# Altium project Sayma_RTM.PrjPcb (part 5 of 11)

## Sheet PWR_buck_FPGA_EXAR.SchDoc: Sayma RTM
size 420 x 297 mm; $$Internal___BlkDate: 23:43:25_12-13-18; $$Internal_NAME_PLACEHOLDER: a3sheet; $$Internal_Resolution: 00001mm; $$NotCommonProperty_@NAME: PWR_buck_FPGA_EXAR; $$NotCommonProperty_@PRINTORDER: 2; $$NotCommonProperty_@SHEET: 1; $$NotCommonProperty_@SHEETTOTAL: 1; $$NotCommonProperty_FORWARD_PCB: 0; CmpIndex: 119; Drawing Author: G.Kasprowicz; Drawing Number: Sayma RTM; Drawing Project: 8 channel SAWG; Drawing Revision: 2.0; SymIndex: 2227; Author: G.Kasprowicz; CompanyName: WUT ISE; DrawnBy: G.Kasprowicz; Organization: WUT ISE; Address1: PW ISE; Address2: Nowowiejska 15/19 00-665 Warsaw; Address3: gkasprow@gmail.com; DocumentNumber: 14; Revision: 1.0; SheetNumber: 14; SheetTotal: 18; ModifiedBy: -; CheckedDate: -; Title2: Quad channel buck (Exar); DivGrp: WUT ISE; Designer: G.Kasprowicz; ModifiedDate: -; ProjectName: Sensor Box
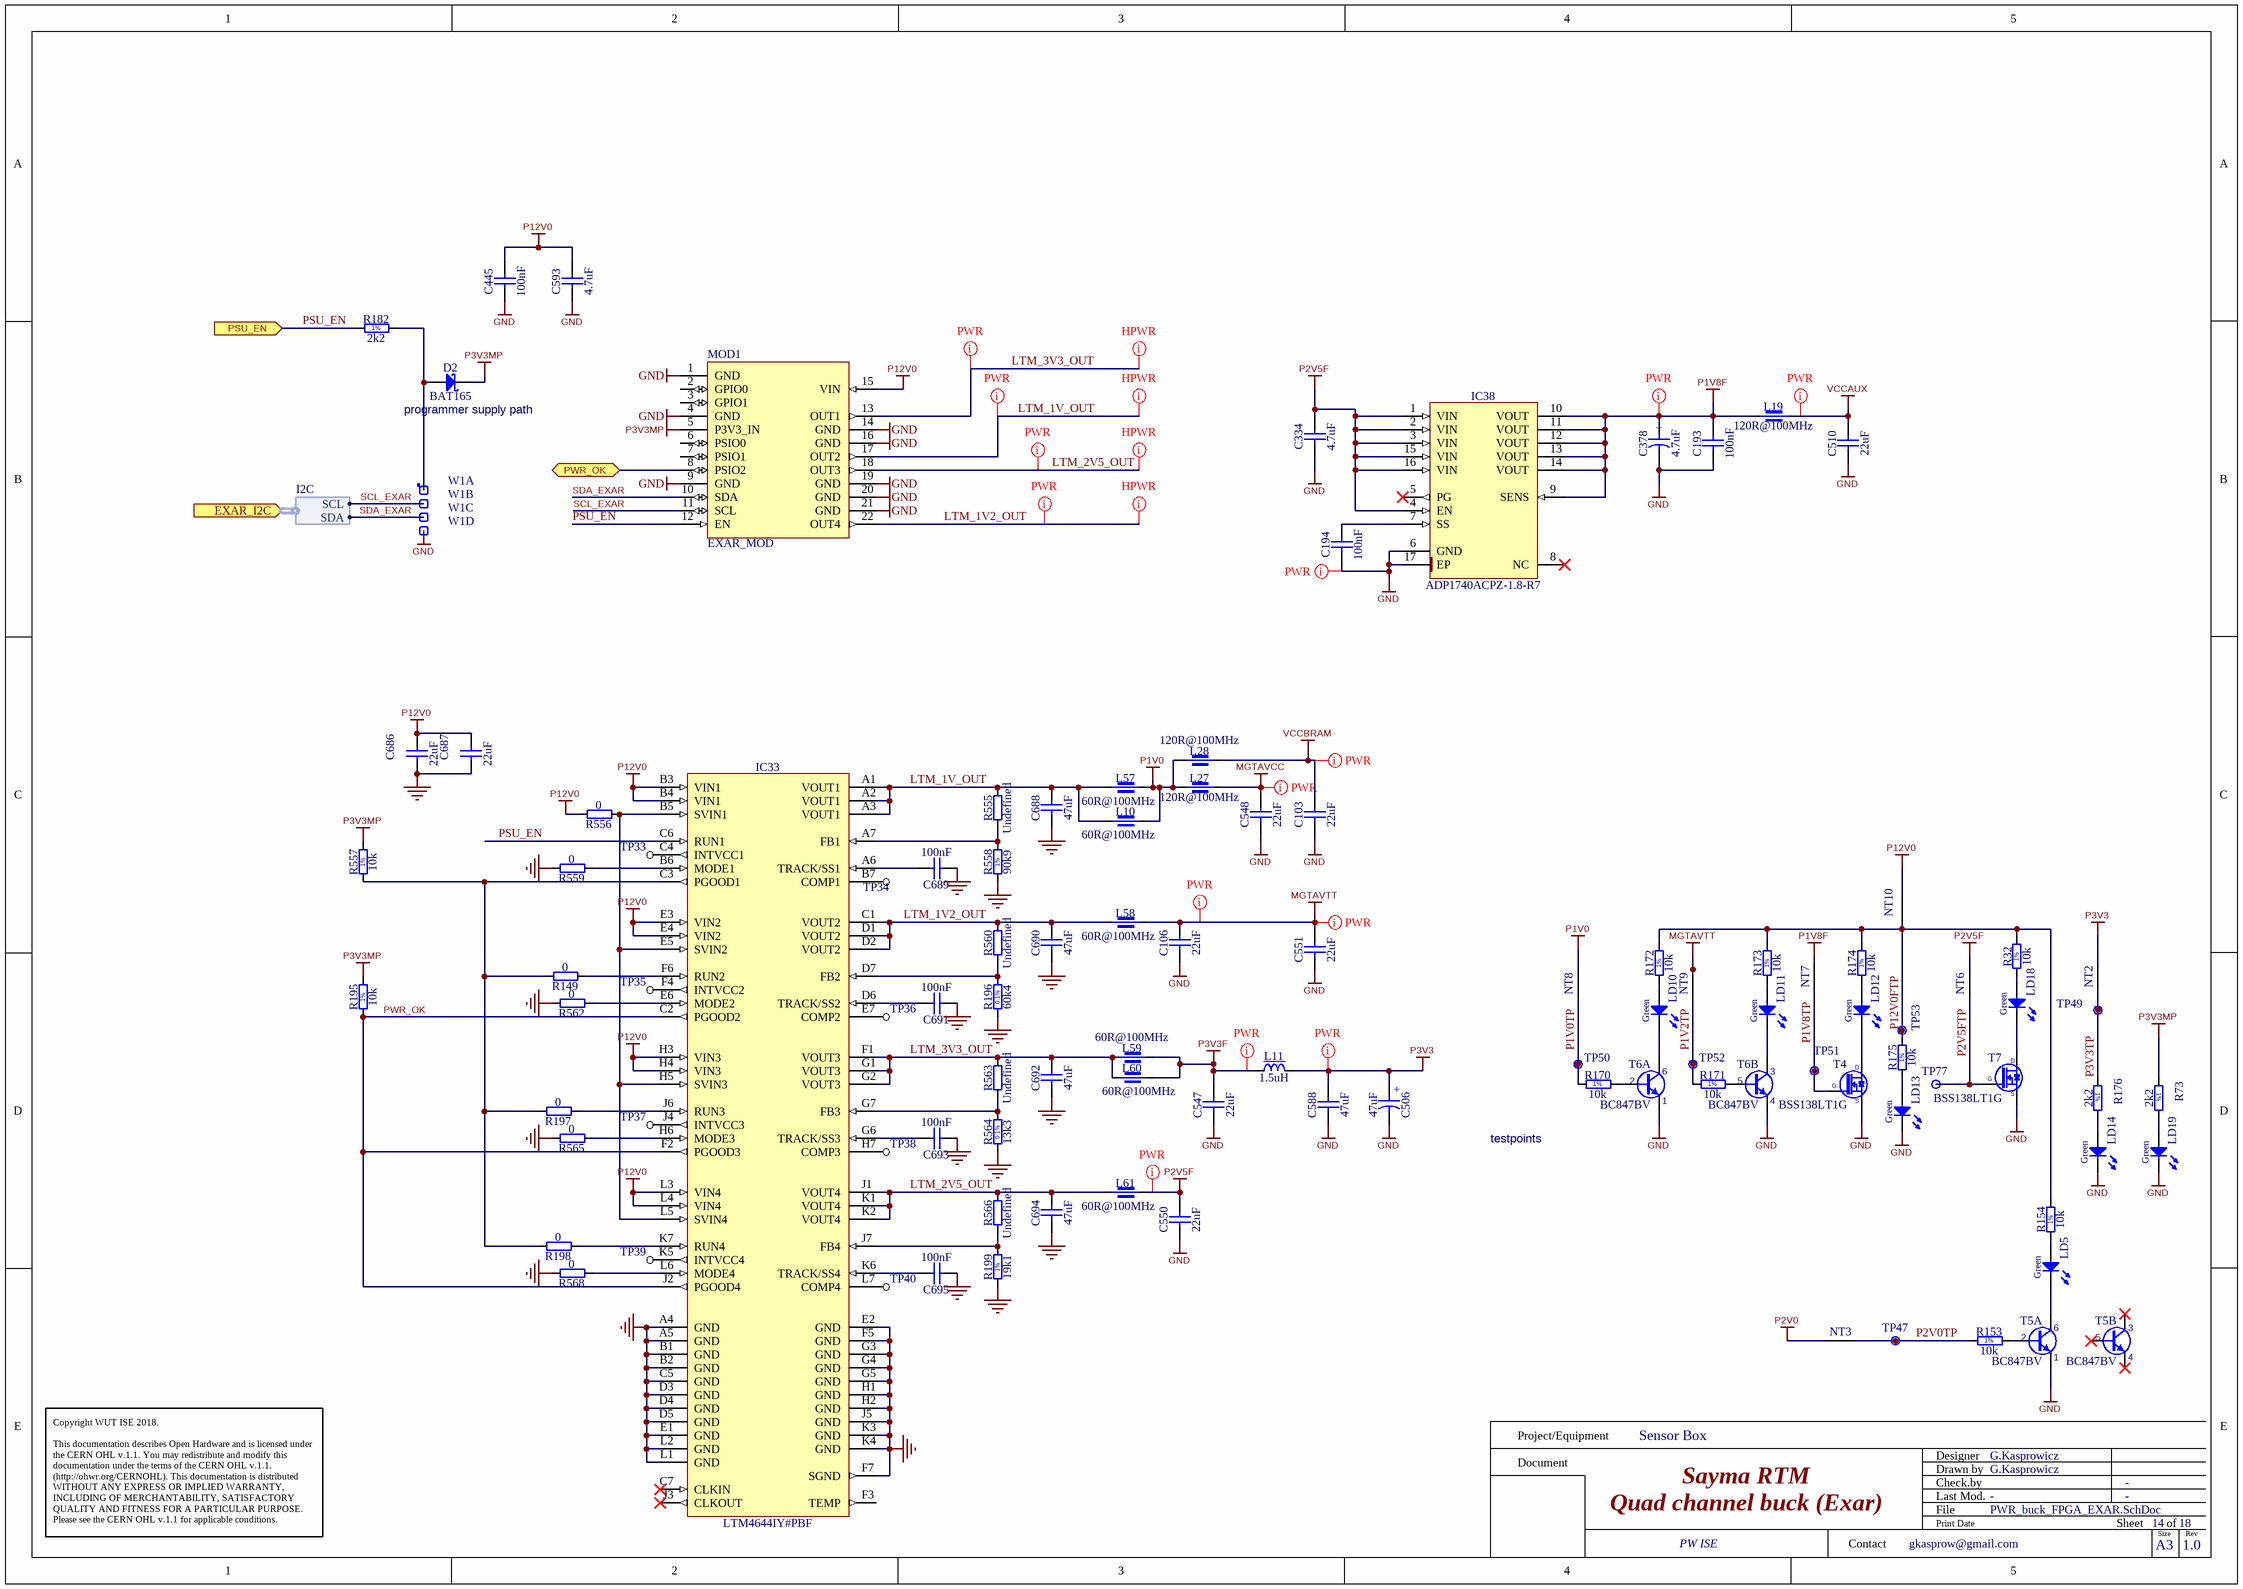
[diagram p8: PWR_buck_FPGA_EXAR.SchDoc]

### Parts
C103  22uF  [CAPC2012X135N]
C106  22uF  [CAPC2012X135N]
C193  100nF  [CAPC0603X33N]
C194  100nF  [CAPC0603X33N]
C334  4.7uF  [CAPC1608X90N]
C378  4.7uF  [CAPMP3528X210N]
C445  100nF  [CAPC1005X55N]
C506  47uF  [CAPMP6032X280N]
C510  22uF  [CAPC2012X135N]
C547  22uF  [CAPC2012X135N]
C548  22uF  [CAPC2012X135N]
C550  22uF  [CAPC2012X135N]
C551  22uF  [CAPC2012X135N]
C588  47uF  [CAPC3225X270N]
C593  4.7uF  [CAPC1709X95N]
C686  22uF  [CAPC2012X135N]
C687  22uF  [CAPC2012X135N]
C688  47uF  [CAPC2012X140N]
C689  100nF  [CAPC1005X55N]
C690  47uF  [CAPC2012X140N]
C691  100nF  [CAPC1005X55N]
C692  47uF  [CAPC2012X140N]
C693  100nF  [CAPC1005X55N]
C694  47uF  [CAPC2012X140N]
C695  100nF  [CAPC1005X55N]
D2  BAT165  [SOD2512X110N]
IC33  LTM4644IY#PBF  [BGA77C127P7X11_900X1500X521]
IC38  ADP1740ACPZ-1.8-R7  [QFN65P400X400X100-17N-S225]
L10  60R@100MHz  [INDC4516X180N]
L11  1.5uH  [IND_TDK_SPM6530]
L19  120R@100MHz  [INDC1608X95N]
L27  120R@100MHz  [INDC1608X95N]
L28  120R@100MHz  [INDC1608X95N]
L57  60R@100MHz  [INDC4516X180N]
L58  60R@100MHz  [INDC4516X180N]
L59  60R@100MHz  [INDC4516X180N]
L60  60R@100MHz  [INDC4516X180N]
L61  60R@100MHz  [INDC4516X180N]
LD5  Green  [LED_KINGBRIGHT_KPH-1608CGCK]
LD10  Green  [LED_KINGBRIGHT_KPH-1608CGCK]
LD11  Green  [LED_KINGBRIGHT_KPH-1608CGCK]
LD12  Green  [LED_KINGBRIGHT_KPH-1608CGCK]
LD13  Green  [LED_KINGBRIGHT_KPH-1608CGCK]
LD14  Green  [LED_KINGBRIGHT_KPH-1608CGCK]
LD18  Green  [LED_KINGBRIGHT_KPH-1608CGCK]
LD19  Green  [LED_KINGBRIGHT_KPH-1608CGCK]
MOD1  EXAR_MOD  [EXAR_MOD]
NT2  Net Tie  [Net Tie]  (value not drawn)  (net tie, no BOM)
NT3  Net Tie  [Net Tie]  (value not drawn)  (net tie, no BOM)
NT6  Net Tie  [Net Tie]  (value not drawn)  (net tie, no BOM)
NT7  Net Tie  [Net Tie]  (value not drawn)  (net tie, no BOM)
NT8  Net Tie  [Net Tie]  (value not drawn)  (net tie, no BOM)
NT9  Net Tie  [Net Tie]  (value not drawn)  (net tie, no BOM)
NT10  Net Tie  [Net Tie]  (value not drawn)  (net tie, no BOM)
R32  10k  [RESC1005X40N]
R73  2k2  [RESC1005X40N]
R149  0  [RESC1005X40N]
R153  10k  [RESC1005X40N]
R154  10k  [RESC1005X40N]
R170  10k  [RESC1005X40N]
R171  10k  [RESC1005X40N]
R172  10k  [RESC1005X40N]
R173  10k  [RESC1005X40N]
R174  10k  [RESC1005X40N]
R175  10k  [RESC1005X40N]
R176  2k2  [RESC1005X40N]
R182  2k2  [RESC1005X40N]
R195  10k  [RESC1005X40N]
R196  60k4  [RESC1608X55N]
R197  0  [RESC1005X40N]
R198  0  [RESC1005X40N]
R199  19k1  [RESC1608X55N]
R555  Undefined  [RESC1608X55N]
R556  0  [RESC1005X40N]
R557  10k  [RESC1005X40N]
R558  90k9  [RESC1608X55N]
R559  0  [RESC1005X40N]
R560  Undefined  [RESC1608X55N]
R562  0  [RESC1005X40N]
R563  Undefined  [RESC1608X55N]
R564  13k3  [RESC1608X55N]
R565  0  [RESC1005X40N]
R566  Undefined  [RESC1608X55N]
R568  0  [RESC1005X40N]
T4  BSS138LT1G  [SOT95P240X110-3N]
T5  BC847BV  [SOTFL50P160X60-6N]  (parts A,B of 2)
T6  BC847BV  [SOTFL50P160X60-6N]  (parts A,B of 2)
T7  BSS138LT1G  [SOT95P240X110-3N]
TP33  TP  [TP]  (value not drawn)
TP34  TP  [TP]  (value not drawn)
TP35  TP  [TP]  (value not drawn)
TP36  TP  [TP]  (value not drawn)
TP37  TP  [TP]  (value not drawn)
TP38  TP  [TP]  (value not drawn)
TP39  TP  [TP]  (value not drawn)
TP40  TP  [TP]  (value not drawn)
TP47  Test Point  [TPS127]  (value not drawn)
TP49  Test Point  [TPS127]  (value not drawn)
TP50  Test Point  [TPS127]  (value not drawn)
TP51  Test Point  [TPS127]  (value not drawn)
TP52  Test Point  [TPS127]  (value not drawn)
TP53  Test Point  [TPS127]  (value not drawn)
TP77  Test Point  [TPS127]  (value not drawn)
W1  Header 4  [SAMTEC_MTLW-104-07-L-S-250]  (value not drawn)  (parts A,B,C,D of 4)

### Ports
EXAR_I2C (in, harness I2C), PSU_EN (in), PWR_OK (bidir)

### Harnesses
I2C: SCL, SDA

### Nets
GND: C103.1 C106.1 C193.1 C194.1 C334.1 C378.2 C445.1 C506.2 C510.1 C547.1 C548.1 C550.1 C551.1 C588.1 C593.1 C686.1 C687.1 C688.1 C689.1 C690.1 C691.1 C692.1 C693.1 C694.1 C695.1 IC33.A4(GND) IC33.A5(GND) IC33.B1(GND) IC33.B2(GND) IC33.C5(GND) IC33.D3(GND) IC33.D4(GND) IC33.D5(GND) IC33.E1(GND) IC33.E2(GND) IC33.F5(GND) IC33.F7(SGND) IC33.G3(GND) IC33.G4(GND) IC33.G5(GND) IC33.H1(GND) IC33.H2(GND) IC33.J5(GND) IC33.K3(GND) IC33.K4(GND) IC33.L1(GND) IC33.L2(GND) IC38.6(GND) IC38.17(EP) LD13.1(C) LD14.1(C) LD19.1(C) MOD1.1(GND) MOD1.4(GND) MOD1.9(GND) MOD1.14(GND) MOD1.16(GND) MOD1.19(GND) MOD1.20(GND) MOD1.21(GND) R196.1 R199.1 R558.1 R559.2 R562.2 R564.1 R565.2 R568.2 T4.2(S) T5.1(E) T6.1(E) T6.4(E) T7.2(S) W1.4
MGTAVCC: C548.2 L27.2
MGTAVTT: C106.2 C551.2 L58.2 NT9.2
P1V0: L10.2 L27.1 L28.1 L57.2 NT8.2
P1V8F: C193.2 C378.1 IC38.9(SENS) IC38.10(VOUT) IC38.11(VOUT) IC38.12(VOUT) IC38.13(VOUT) IC38.14(VOUT) L19.1 NT7.2
P2V0: NT3.1
P2V5F: C334.2 C550.2 IC38.1(VIN) IC38.2(VIN) IC38.3(VIN) IC38.4(EN) IC38.15(VIN) IC38.16(VIN) L61.2 NT6.2
P3V3: C506.1 C588.2 L11.2 NT2.2
P3V3F: C547.2 L11.1 L59.2 L60.2
P3V3MP: D2.1(C) MOD1.5(P3V3_IN) R73.1 R195.2 R557.2
P12V0: C445.2 C593.2 C686.2 C687.2 IC33.B3(VIN1) IC33.B4(VIN1) IC33.E3(VIN2) IC33.E4(VIN2) IC33.H3(VIN3) IC33.H4(VIN3) IC33.L3(VIN4) IC33.L4(VIN4) MOD1.15(VIN) NT10.2 R556.2
VCCAUX: C510.2 L19.2
VCCBRAM: C103.2 L28.2
LTM_1V2_OUT: C690.2 IC33.C1(VOUT2) IC33.D1(VOUT2) IC33.D2(VOUT2) L58.1 MOD1.22(OUT4) R560.2
LTM_1V_OUT: C688.2 IC33.A1(VOUT1) IC33.A2(VOUT1) IC33.A3(VOUT1) L10.1 L57.1 MOD1.17(OUT2) R555.2
LTM_2V5_OUT: C694.2 IC33.J1(VOUT4) IC33.K1(VOUT4) IC33.K2(VOUT4) L61.1 MOD1.18(OUT3) R566.2
LTM_3V3_OUT: C692.2 IC33.F1(VOUT3) IC33.G1(VOUT3) IC33.G2(VOUT3) L59.1 L60.1 MOD1.13(OUT1) R563.2
P1V0TP: NT8.1 R170.1 TP50.1
P1V2TP: NT9.1 R171.1 TP52.1
P1V8TP: NT7.1 T4.1(G) TP51.1
P2V0TP: NT3.2 R153.1 TP47.1
P2V5FTP: NT6.1 T7.1(G) TP77.1
P3V3TP: NT2.1 R176.1 TP49.1
P12V0FTP: NT10.1 R32.2 R154.2 R172.2 R173.2 R174.2 R175.2 TP53.1
PGOOD: MOD1.8(PSIO2) ; port PWR_OK
PSU_EN: IC33.C6(RUN1) MOD1.12(EN) R182.1 ; port PSU_EN  [project net EN]
PWR_OK: IC33.C2(PGOOD2) IC33.F2(PGOOD3) IC33.J2(PGOOD4) R195.1
SCL_EXAR: MOD1.11(SCL) W1.2 ; port EXAR_I2C.SCL  [project net EXAR_I2C.SCL]
SDA_EXAR: MOD1.10(SDA) W1.3 ; port EXAR_I2C.SDA  [project net EXAR_I2C.SDA]
NetC194_2: C194.2 IC38.7(SS)
NetC689_2: C689.2 IC33.A6(TRACK/SS1)
NetC691_2: C691.2 IC33.D6(TRACK/SS2)
NetC693_2: C693.2 IC33.G6(TRACK/SS3)
NetC695_2: C695.2 IC33.K6(TRACK/SS4)
NetD2_2: D2.2(A) R182.2 W1.1
NetIC33_A7: IC33.A7(FB1) R555.1 R558.2
NetIC33_B5: IC33.B5(SVIN1) IC33.E5(SVIN2) IC33.H5(SVIN3) IC33.L5(SVIN4) R556.1
NetIC33_B6: IC33.B6(MODE1) R559.1
NetIC33_B7: IC33.B7(COMP1) TP34.1
NetIC33_C3: IC33.C3(PGOOD1) R149.2 R197.2 R198.2 R557.1
NetIC33_C4: IC33.C4(INTVCC1) TP33.1
NetIC33_D7: IC33.D7(FB2) R196.2 R560.1
NetIC33_E6: IC33.E6(MODE2) R562.1
NetIC33_E7: IC33.E7(COMP2) TP36.1
NetIC33_F4: IC33.F4(INTVCC2) TP35.1
NetIC33_F6: IC33.F6(RUN2) R149.1
NetIC33_G7: IC33.G7(FB3) R563.1 R564.2
NetIC33_H6: IC33.H6(MODE3) R565.1
NetIC33_H7: IC33.H7(COMP3) TP38.1
NetIC33_J4: IC33.J4(INTVCC3) TP37.1
NetIC33_J6: IC33.J6(RUN3) R197.1
NetIC33_J7: IC33.J7(FB4) R199.2 R566.1
NetIC33_K5: IC33.K5(INTVCC4) TP39.1
NetIC33_K7: IC33.K7(RUN4) R198.1
NetIC33_L6: IC33.L6(MODE4) R568.1
NetIC33_L7: IC33.L7(COMP4) TP40.1
NetLD5_1: LD5.1(C) T5.6(C)
NetLD5_2: LD5.2(A) R154.1
NetLD10_1: LD10.1(C) T6.6(C)
NetLD10_2: LD10.2(A) R172.1
NetLD11_1: LD11.1(C) T6.3(C)
NetLD11_2: LD11.2(A) R173.1
NetLD12_1: LD12.1(C) T4.3(D)
NetLD12_2: LD12.2(A) R174.1
NetLD13_2: LD13.2(A) R175.1
NetLD14_2: LD14.2(A) R176.2
NetLD18_1: LD18.1(C) T7.3(D)
NetLD18_2: LD18.2(A) R32.1
NetLD19_2: LD19.2(A) R73.2
NetR153_2: R153.2 T5.2(B)
NetR170_2: R170.2 T6.2(B)
NetR171_2: R171.2 T6.5(B)

Not connected (* = marked no-connect by the designer): IC33 C7(CLKIN)* F3(TEMP) J3(CLKOUT)*; IC38 5(PG)* 8(NC)*; MOD1 2(GPIO0) 3(GPIO1) 6(PSIO0) 7(PSIO1); T5 3(C)* 4(E)* 5(B)*

### Layout directives
net class PWR: GND, LTM_1V2_OUT, LTM_1V_OUT, LTM_2V5_OUT, LTM_3V3_OUT, MGTAVCC, MGTAVTT, P1V8F, P2V5F, P3V3, P3V3F, VCCAUX, VCCBRAM
net class HPWR: LTM_1V2_OUT, LTM_1V_OUT, LTM_2V5_OUT, LTM_3V3_OUT

### Notes on the sheet
- (near D2) programmer supply path
- testpoints
- Project/Equipment
- Document
- Designer
- Drawn by
- Check.by
- Copyright WUT ISE 2018.
  This documentation describes Open Hardware and is licensed under the CERN OHL v.1.1. You may redistribute and modify this documentation under the terms of the CERN OHL v.1.1. (http://ohwr.org/CERNOHL). This documentation is distributed WITHOUT ANY EXPRESS OR IMPLIED WARRANTY, INCLUDING OF MERCHANTABILITY, SATISFACTORY QUALITY AND FITNESS FOR A PARTICULAR PURPOSE. Please see the CERN OHL v.1.1 for applicable conditions.
- Contact
- File
- Last Mod.
- Print Date
- Sheet
- Size
- A3
- of
- Rev
- (in symbol CTE3528-21_4.7UF_35V_10%) +
- (in symbol CTE6032-28_47UF_16V_10%_LESR0350) +
- (in symbol R0402_2K2_1%_0.0625W_100PPM) 1%
- (in symbol R0402_10K_1%_0.0625W_100PPM) 1%
- (in symbol R0603_13K3_0.1%_0.063W_10PPM) 0.1%
- (in symbol R0603_19k1_1%_0.1W_100PPM) 1%
- (in symbol R0603_60K4_0.1%_0.063W_10PPM) 0.1%
- (in symbol R0603_90K9_1%_0.1W_100PPM) 1%

### Library data of the parts
C103 C106 C510 C547 C548 C550 C551 = CC0805_22UF_6.3V_20%_X5R: Non-polarised capacitor; Manufacturer: GENERIC; Manufacturer1 Part Number: C0805C226M9PAC7800; Part Description: SMD Multilayer Chip Ceramic Capacitor; TC: X5R; Tolerance: ±20%; Voltage: 6.3V; Case: 0805; Manufacturer Part Number: CC0805_22UF_6.3V_20%_X5R; Manufacturer1 Example: KEMET; Part Number: CC0805_22UF_6.3V_20%_X5R; Pin Count: 2; SMD: Yes; Status: Preferred; Value: 22uF; Component Kind: Standard; Component Type: Standard; Mounted: Yes; Socket: No; Sense: No; Manufacturer1 ComponentHeight: 1.45mm; HelpURL: \\cern.ch\dfs\Applications\Altium\Datasheets\CC1206_X5R_KEMET.pdf; Author: CERN DEM JLC; CreateDate: 03.12.2007; LatestRevisionDate: 03.12.2007
C193 C194 = CC0201_100NF_6.3V_10%_X5R: Non-polarised capacitor; Manufacturer: GENERIC; Manufacturer1 Part Number: 02016D104KAT2A; Part Description: SMD Multilayer Chip Ceramic Capacitor; TC: X5R; Tolerance: ±10%; Voltage: 6.3V; Case: 0201; Manufacturer Part Number: CC0201_100NF_6.3V_10%_X5R; Manufacturer1 Example: AVX; Part Number: CC0201_100NF_6.3V_10%_X5R; Pin Count: 2; SMD: Yes; Status: Not Recommended; Value: 100nF; Component Kind: Standard; Component Type: Standard; Mounted: Yes; Socket: No; Sense: No; Manufacturer1 ComponentHeight: 0.33mm; HelpURL: \\cern.ch\dfs\Applications\Altium\Datasheets\CC0201_X5R_AVX.pdf; Author: CERN DEM JLC; CreateDate: 03.12.2007; LatestRevisionDate: 03.12.2007
C334 = CC0603_4.7UF_25V_10%_X5R: Non-polarised capacitor; Manufacturer: GENERIC; Manufacturer1 Part Number: GRM188R61E475KE11D; Part Description: SMD Multilayer Chip Ceramic Capacitor; Tolerance: ±10%; Voltage: 25V; TC: X5R; Case: 0603; Manufacturer Part Number: CC0603_4.7UF_25V_10%_X5R; Manufacturer1 Example: MURATA; Part Number: CC0603_4.7UF_25V_10%_X5R; Pin Count: 2; SMD: Yes; Value: 4.7uF; Component Kind: Standard; Component Type: Standard; Status: None; Mounted: Yes; Socket: No; Sense: No; Manufacturer1 ComponentHeight: 0.95mm; HelpURL: \\cern.ch\dfs\Applications\Altium\Datasheets\CC0603_MURATA_GRM188R61E475KE11D.pdf; Author: CERN DEM JLC; CreateDate: 10.11.2014; LatestRevisionDate: 10.11.2014
C378 = CTE3528-21_4.7UF_35V_10%: Polarised capacitor; Manufacturer: GENERIC; Manufacturer1 Part Number: TAJB475K035R; Part Description: Solid Tantalum Chip Capacitor; Tolerance: ±10%; Voltage: 35V; Case: B; Manufacturer Part Number: CTE3528-21_4.7UF_35V_10%; Manufacturer1 Example: AVX; Part Number: CTE3528-21_4.7UF_35V_10%; Pin Count: 2; SMD: Yes; Value: 4.7uF; Component Kind: Standard; Component Type: Standard; Status: Preferred; Mounted: Yes; Socket: No; Sense: No; Manufacturer1 ComponentHeight: 2.1mm; HelpURL: \\cern.ch\dfs\Applications\Altium\Datasheets\CTE_AVX_TAJ.pdf; Author: CERN DEM JLC; CreateDate: 03.12.2007; LatestRevisionDate: 03.12.2007
C445 = CC0402_100NF_16V_10%_X5R: Non-polarised capacitor; Manufacturer: GENERIC; Manufacturer1 Part Number: GRM155R61C104KA88D; Part Description: SMD Multilayer Chip Ceramic Capacitor; TC: X5R; Tolerance: ±10%; Voltage: 16V; Case: 0402; Manufacturer Part Number: CC0402_100NF_16V_10%_X5R; Manufacturer1 Example: MURATA; Part Number: CC0402_100NF_16V_10%_X5R; Pin Count: 2; SMD: Yes; Status: None; Value: 100nF; Component Kind: Standard; Component Type: Standard; Mounted: Yes; Socket: No; Sense: No; Manufacturer1 ComponentHeight: 0.55mm; HelpURL: \\cern.ch\dfs\Applications\Altium\Datasheets\CC0402_X5R_MURATA_GRM.pdf; Author: CERN DEM JLC; CreateDate: 10.12.2013; LatestRevisionDate: 10.12.2013
C506 = CTE6032-28_47UF_16V_10%_LESR0350: Polarised capacitor; Manufacturer: GENERIC; Manufacturer1 Part Number: TPSC476K016R0350; Part Description: Low ESR 0R350 Solid Tantalum Chip Capacitor; Tolerance: ±10%; Voltage: 16V; Case: C; Manufacturer Part Number: CTE6032-28_47UF_16V_10%_LESR0350; Manufacturer1 Example: AVX; Part Number: CTE6032-28_47UF_16V_10%_LESR0350; Pin Count: 2; SMD: Yes; Status: Preferred; Value: 47uF; Component Kind: Standard; Component Type: Standard; Mounted: Yes; Socket: No; Sense: No; Manufacturer1 ComponentHeight: 2.8mm; HelpURL: \\cern.ch\dfs\Applications\Altium\Datasheets\CTE-LESR_AVX_TPS.pdf; Author: CERN DEM JLC; CreateDate: 05.05.2008; LatestRevisionDate: 20.01.2009
C588 = CC1210_47UF_10V_10%_X7R: Non-polarised capacitor; Manufacturer: GENERIC; Manufacturer1 Part Number: GRM32ER71A476KE15; Part Description: SMD Multilayer Chip Ceramic Capacitor; TC: X7R; Tolerance: ±10%; Voltage: 10V; Case: 1210; Manufacturer Part Number: CC1210_47UF_10V_10%_X7R; Manufacturer1 Example: MURATA; Part Number: CC1210_47UF_10V_10%_X7R; Pin Count: 2; SMD: Yes; Status: None; Value: 47uF; Component Kind: Standard; Component Type: Standard; Mounted: Yes; Socket: No; Sense: No; Manufacturer1 ComponentHeight: 2.7mm; HelpURL: \\cern.ch\dfs\Applications\Altium\Datasheets\CC1210_X7R_MURATA.pdf; Author: CERN DEM BC; CreateDate: 18.11.2015; LatestRevisionDate: 18.11.2015
C593 = CC0603_4.7UF_16V_10%_X5R: Non-polarised capacitor; Manufacturer: GENERIC; Manufacturer1 Part Number: EMK107ABJ475KA-T; Part Description: SMD Multilayer Chip Ceramic Capacitor; TC: X5R; Tolerance: ±10%; Voltage: 16V; Case: 0603; Manufacturer Part Number: CC0603_4.7UF_16V_10%_X5R; Manufacturer1 Example: TAIYO YUDEN; Part Number: CC0603_4.7UF_16V_10%_X5R; Pin Count: 2; SMD: Yes; Status: None; Value: 4.7uF; Component Kind: Standard; Component Type: Standard; Mounted: Yes; Socket: No; Sense: No; Manufacturer1 ComponentHeight: 0.95mm; HelpURL: \\cern.ch\dfs\Applications\Altium\Datasheets\CC0603_X7R_TAIYO-YUDEN_HIGH-VALUE.pdf; Author: CERN DEM JLC; CreateDate: 16.12.2013; LatestRevisionDate: 16.09.2014
C686 C687 = CC0805_22UF_16V_10%_X5R: Non-polarised capacitor; Manufacturer: GENERIC; Part Description: SMD Multilayer Chip Ceramic Capacitor; Manufacturer1 Part Number: C2012X5R1C226KT; Tolerance: ±10%; Voltage: 16V; TC: X5R; Manufacturer Part Number: CC0805_22UF_16V_10%_X5R; Part Number: CC0805_22UF_16V_10%_X5R; Value: 22uF; Component Kind: Standard; Component Type: Standard; Pin Count: 2; Status: Preferred; Case: 0805; Mounted: Yes; Socket: No; SMD: Yes; Sense: No; Manufacturer1 Example: TDK; Manufacturer1 ComponentHeight: 1.35mm; HelpURL: \\cern.ch\dfs\Applications\Altium\Datasheets\CC0805_X5R_TDK_C.pdf; Author: CERN DEM JLC; CreateDate: 25.10.2012; LatestRevisionDate: 25.10.2012
C688 C690 C692 C694 = CC0805_47UF_6.3V_20%_X5R: Non-polarised capacitor; Manufacturer: GENERIC; Part Description: SMD Multilayer Chip Ceramic Capacitor; Manufacturer1 Part Number: C0805C476M9PACTU; Tolerance: ±20%; Voltage: 6.3V; TC: X5R; Manufacturer Part Number: CC0805_47UF_6.3V_20%_X5R; Part Number: CC0805_47UF_6.3V_20%_X5R; Value: 47uF; Component Kind: Standard; Component Type: Standard; Pin Count: 2; Status: Preferred; Case: 0805; Mounted: Yes; Socket: No; SMD: Yes; Sense: No; Manufacturer1 Example: KEMET; Manufacturer1 ComponentHeight: 1.4mm; HelpURL: \\cern.ch\dfs\Applications\Altium\Datasheets\CC0805_X5R_KEMET.pdf; Author: CERN DEM JLC; CreateDate: 16.10.2012; LatestRevisionDate: 16.10.2012
C689 C691 C693 C695 = CC0402_100NF_16V_10%_X5R: Non-polarised capacitor; Part Description: SMD Multilayer Chip Ceramic Capacitor; Manufacturer: GENERIC; Manufacturer1 Part Number: GRM155R61C104KA88D; Voltage: 16V; TC: X5R; Tolerance: ±10%; Part Number: CC0402_100NF_16V_10%_X5R; Component Kind: Standard; Component Type: Standard; Pin Count: 2; Value: 100nF; Status: None; Manufacturer Part Number: CC0402_100NF_16V_10%_X5R; Case: 0402; Mounted: Yes; Socket: No; SMD: Yes; Sense: No; Manufacturer1 Example: MURATA; Manufacturer1 ComponentHeight: 0.55mm; HelpURL: \\cern.ch\dfs\Applications\Altium\Datasheets\CC0402_X5R_MURATA_GRM.pdf; Author: CERN DEM JLC; CreateDate: 10.12.2013; LatestRevisionDate: 10.12.2013
D2 = BAT165: Schottky Diode; Manufacturer: INFINEON; Part Description: Medium Power AF Schottky Diode; Bonding: No; Power: 750mA; PressFit: No; Voltage: 40V; Case: SOD323; ComponentHeight: 1.1mm; Device: BAT165; Manufacturer Part Number: BAT165; Mounted: Yes; PackageDescription: Small Outline Diode (SOD-323), 1.70mm W X 1.25mm L X 1.10mm H body,  IPC Medium Density; Part Number: BAT165; Pin Count: 2; Sense: No; SMD: Yes; Socket: No; Component Kind: Standard; Component Type: Standard; HelpURL: \\cern.ch\dfs\Applications\Altium\Datasheets\BAT165.pdf; Author: CERN DEM JLC; CreateDate: 12.11.2014; LatestRevisionDate: 12.11.2014
IC33 = LTM4644IY#PBF: Quad DC/DC µModule Regulator with Configurable 4A Output Array; Part Description: 4V-14V to 0.6V-5.5V Quad DC/DC uModule (Power Module) Regulator with Configurable 4A Output Array; Manufacturer: LINEAR TECHNOLOGY; PressFit: No; Bonding: No; Part Number: LTM4644IY#PBF; Component Kind: Standard; Component Type: Standard; Device: LTM4644IY#PBF; PackageDescription: BGA, 1.27mm Pitch, Rect.; 77 Pin, 7 Columns X 11 Rows, 9.00mm X 15.00mm X 5.21mm H; Manufacturer Part Number: LTM4644IY#PBF; Pin Count: 77; Case: BGA77; Mounted: Yes; Socket: No; SMD: Yes; Sense: No; ComponentHeight: 5.21mm; HelpURL: \\cern.ch\dfs\Applications\Altium\Datasheets\LTM4644IY#PBF.pdf; Author: CERN DEM JLC; CreateDate: 25.04.2018; LatestRevisionDate: 25.04.2018
IC38 = ADP1740ACPZ-1.8-R7: 2A, Low-Dropout Linear Regulator; Manufacturer: ANALOG DEVICES; Part Description: 1.8V, 2A, Low-Dropout Linear Regulator; Bonding: No; PressFit: No; Case: QFN16; ComponentHeight: 1mm; Device: ADP1740ACPZ-1.8-R7; Manufacturer Part Number: ADP1740ACPZ-1.8-R7; Mounted: Yes; PackageDescription: QFN, 0.65mm pitch,square; 4 pin X 4 pin, 4mm X 4mm X 1mm H body (w/thermal tab 2.25 X 2.25mm),  IPC Medium Density; Part Number: ADP1740ACPZ-1.8-R7; Pin Count: 17; Sense: No; SMD: Yes; Socket: No; Component Kind: Standard; Component Type: Standard; HelpURL: \\cern.ch\dfs\Applications\Altium\Datasheets\ADP1740ACPZ-1.8-R7.pdf; Author: CERN DEM JLC; CreateDate: 05.02.2013; LatestRevisionDate: 05.02.2013
L10 L57-L61 = IND1806_MURATA_BLM41PG600SN1L: Manufacturer: MURATA; Part Description: SMD EMI Suppression Chip Ferrite Bead (BLM41P Series); Power: 6A; Resistance: 0.01R; Case: 1806; ComponentHeight: 1.8mm; Manufacturer Part Number: BLM41PG600SN1L; Part Number: IND1806_MURATA_BLM41PG600SN1L; Pin Count: 2; SMD: Yes; Value: 60R@100MHz; Component Kind: Standard; Component Type: Standard; Status: None; Mounted: Yes; Socket: No; Sense: No; HelpURL: \\cern.ch\dfs\Applications\Altium\Datasheets\IND1806_MURATA_BLM41P.pdf; Author: CERN DEM JLC; CreateDate: 02.12.2009; LatestRevisionDate: 02.12.2009
L11 = IND_1.5UH_20%_TDK_SPM6530: Inductor With Core; Manufacturer Part Number: SPM6530T-1R5M100; Manufacturer: TDK; Part Description: SMD Inductor for Power Circuits (Wound Metal), SPM Series; Power: 11A; Resistance: 0.0097R; Tolerance: ±20%; ComponentHeight: 3mm; Part Number: IND_1.5UH_20%_TDK_SPM6530; Pin Count: 2; SMD: Yes; Value: 1.5uH; Component Kind: Standard; Component Type: Standard; Status: None; Mounted: Yes; Socket: No; Sense: No; HelpURL: \\cern.ch\dfs\Applications\Altium\Datasheets\IND_TDK_SPM6530.pdf; Author: CERN DEM MR; CreateDate: 08.11.2016; LatestRevisionDate: 08.11.2016
L19 L27 L28 = IND0603_MURATA_BLM18PG121SN1D: Manufacturer: MURATA; Part Description: SMD EMIFIL Chip Ferrite Bead; Power: 2A; Resistance: 0.05R; Case: 0603; ComponentHeight: 0.95mm; Manufacturer Part Number: BLM18PG121SN1D; Part Number: IND0603_MURATA_BLM18PG121SN1D; Pin Count: 2; SMD: Yes; Value: 120R@100MHz; Component Kind: Standard; Component Type: Standard; Status: None; Mounted: Yes; Socket: No; Sense: No; HelpURL: \\cern.ch\dfs\Applications\Altium\Datasheets\IND0603_MURATA_BLM18P.pdf; Author: CERN DEM BC; CreateDate: 27.07.2015; LatestRevisionDate: 25.10.2018
LD5 LD10-LD14 LD18 LD19 = LED_KINGBRIGHT_KPH-1608CGCK: LED Green 1C 2A; Part Description: SMD Green LED, Case 1.6mmX0.8mm(0603), 0.65mm Thickness; Bonding: No; PressFit: No; Author: CERN DEM JLC; Color: Green; Component Kind: Standard; Component Type: Standard; ComponentHeight: 0.65mm; CreateDate: 03.07.2017; HelpURL: \\cern.ch\dfs\Applications\Altium\Datasheets\LED_KINGBRIGHT_KPH-1608CGCK.pdf; LatestRevisionDate: 03.07.2017; Manufacturer Part Number: KPH-1608CGCK; Manufacturer: KINGBRIGHT; Mounted: Yes; PackageDescription: SMT Green LED, Case 0603, Body L 1.6 x W 0.8mm H 0.65mm; Part Number: LED_KINGBRIGHT_KPH-1608CGCK; Pin Count: 2; Sense: No; SMD: Yes; Socket: No
MOD1 = DC/DC_EXAR_MOD: 4 channel PCB module based on XRP7724ILB-F
NT2 NT3 NT6-NT10 = Net Tie: Part Description: Net Tie (2 Nets); Mounted: No; Part Number: Net Tie; Component Type: Net Tie; Pin Count: 2; Family: Net Tie; Socket: No; SMD: No; Sense: No; Status: None; ComponentHeight: 0mm; HelpURL: Undefined; Author: CERN DEM JLC; CreateDate: 22.03.2011; LatestRevisionDate: 22.03.2011; PackageDescription: 2 Plated Through Hole For Coaxial Cable Link: Hole Dia.=1.4mm Pad Dia.=2.5mm
R32 R153 R154 R170-R175 = R0402_10K_1%_0.0625W_100PPM: Resistor - 1%; Manufacturer: GENERIC; Manufacturer1 Part Number: 232270671003L; Part Description: General Purpose Thick Film Chip Resistor; TC: ±100ppm/°C; PressFit: No; Case: 0402; Manufacturer Part Number: R0402_10K_1%_0.0625W_100PPM; Manufacturer1 ComponentHeight: 0.4mm; Manufacturer1 Example: YAGEO PHYCOMP; Part Number: R0402_10K_1%_0.0625W_100PPM; Pin Count: 2; Power: 0.0625W; Sense: No; SMD: Yes; Status: Not Recommended; Tolerance: ±1%; Value: 10k; Component Kind: Standard; Component Type: Standard; Mounted: Yes; Socket: No; HelpURL: \\cern.ch\dfs\Applications\Altium\Datasheets\R0402_Phycomp_RC0402.pdf; Author: CERN DEM JLC; CreateDate: 03.12.2007; LatestRevisionDate: 17.10.2012
R73 R176 R182 = R0402_2K2_1%_0.0625W_100PPM: Resistor - 1%; Manufacturer: GENERIC; Manufacturer1 Part Number: 232270672202L; Part Description: General Purpose Thick Film Chip Resistor; TC: ±100ppm/°C; PressFit: No; Case: 0402; Manufacturer Part Number: R0402_2K2_1%_0.0625W_100PPM; Manufacturer1 ComponentHeight: 0.4mm; Manufacturer1 Example: YAGEO PHYCOMP; Part Number: R0402_2K2_1%_0.0625W_100PPM; Pin Count: 2; Power: 0.0625W; Sense: No; SMD: Yes; Status: Not Recommended; Tolerance: ±1%; Value: 2k2; Component Kind: Standard; Component Type: Standard; Mounted: Yes; Socket: No; HelpURL: \\cern.ch\dfs\Applications\Altium\Datasheets\R0402_Phycomp_RC0402.pdf; Author: CERN DEM JLC; CreateDate: 03.12.2007; LatestRevisionDate: 17.10.2012
R149 R197 R198 R556 R559 R562 R565 R568 = R0402_0R_JUMPER: Resistor; Manufacturer: GENERIC; Part Description: 1A (0.05R Max DC Resistance) Zero Ohm Jumper; Manufacturer1 Part Number: 232270591001L; PressFit: No; Manufacturer Part Number: R0402_0R_JUMPER; Part Number: R0402_0R_JUMPER; Value: 0; Component Kind: Standard; Component Type: Standard; Pin Count: 2; Status: Not Recommended; Case: 0402; Mounted: Yes; Sense: No; Socket: No; SMD: Yes; Manufacturer1 Example: YAGEO PHYCOMP; Manufacturer1 ComponentHeight: 0.4mm; HelpURL: \\cern.ch\dfs\Applications\Altium\Datasheets\R0402_Phycomp_RC0402.pdf; Author: CERN DEM JLC; CreateDate: 03.12.2007; LatestRevisionDate: 17.10.2012
R195 R557 = R0402_10K_1%_0.0625W_100PPM: Resistor - 1%; Manufacturer: GENERIC; Part Description: General Purpose Thick Film Chip Resistor; Manufacturer1 Part Number: 232270671003L; TC: ±100ppm/°C; PressFit: No; Manufacturer Part Number: R0402_10K_1%_0.0625W_100PPM; Part Number: R0402_10K_1%_0.0625W_100PPM; Tolerance: ±1%; Value: 10k; Component Kind: Standard; Component Type: Standard; Pin Count: 2; Status: Not Recommended; Power: 0.0625W; Case: 0402; Mounted: Yes; Sense: No; Socket: No; SMD: Yes; Manufacturer1 Example: YAGEO PHYCOMP; Manufacturer1 ComponentHeight: 0.4mm; HelpURL: \\cern.ch\dfs\Applications\Altium\Datasheets\R0402_Phycomp_RC0402.pdf; Author: CERN DEM JLC; CreateDate: 03.12.2007; LatestRevisionDate: 17.10.2012
R196 = R0603_60K4_0.1%_0.063W_10PPM: Resistor - 0.1%; Part Description: Thin Film Chip Resistor; Manufacturer: GENERIC; Manufacturer1 Part Number: RN73C1J60K4BTDF; Power: 0.063W; TC: ±10ppm; PressFit: No; Part Number: R0603_60K4_0.1%_0.063W_10PPM; Component Kind: Standard; Component Type: Standard; Pin Count: 2; Value: 60k4; Status: Not Recommended; Tolerance: ±0.1%; Manufacturer Part Number: R0603_60K4_0.1%_0.063W_10PPM; Case: 0603; Mounted: Yes; Sense: No; Socket: No; SMD: Yes; Manufacturer1 Example: TYCO HOLSWORTHY; Manufacturer1 ComponentHeight: 0.5mm; HelpURL: \\cern.ch\dfs\Applications\Altium\Datasheets\R0603_Tyco_RN73.pdf; Author: CERN DEM JLC; CreateDate: 03.12.2007; LatestRevisionDate: 13.03.2008
R199 = R0603_19k1_1%_0.1W_100PPM: Resistor - 1%; Part Description: General Purpose Thick Film Chip Resistor; Manufacturer: GENERIC; Manufacturer1 Part Number: CRCW060319K1FKEA; Power: 0.1W; TC: ±100ppm/°C; PressFit: No; Part Number: R0603_19k1_1%_0.1W_100PPM; Component Kind: Standard; Component Type: Standard; Pin Count: 2; Value: 19k1; Status: Preferred; Tolerance: ±1%; Manufacturer Part Number: R0603_19k1_1%_0.1W_100PPM; Case: 0603; Mounted: Yes; Sense: No; Socket: No; SMD: Yes; Manufacturer1 Example: VISHAY; Manufacturer1 ComponentHeight: 0.55mm; HelpURL: \\cern.ch\dfs\Applications\Altium\Datasheets\R0603_VISHAY_CRCW e3.pdf; Author: CERN DEM JLC; CreateDate: 15.07.2010; LatestRevisionDate: 11.12.2013
R555 R560 R563 R566 = R0603_NO-VALUE: Resistor; Part Description: Reserved Footprint For a 0603 (1608) Chip Resistor; PressFit: No; Mounted: No; Part Number: R0603_NO-VALUE; Component Kind: Standard; Component Type: Standard; Pin Count: 2; Value: Undefined; Status: None; Manufacturer: Undefined; Manufacturer Part Number: R0603_NO-VALUE; Case: 0603; Sense: No; Socket: No; SMD: Yes; Manufacturer1 Example: Undefined; Manufacturer1 Part Number: Undefined; Manufacturer1 ComponentHeight: Undefined; HelpURL: Undefined; Author: CERN DEM JLC; CreateDate: 03.12.2007; LatestRevisionDate: 13.03.2008
R558 = R0603_90K9_1%_0.1W_100PPM: Resistor - 1%; Part Description: General Purpose Thick Film Chip Resistor; Manufacturer: GENERIC; Manufacturer1 Part Number: CRCW060390K9FKEA; Power: 0.1W; TC: ±100ppm/°C; PressFit: No; Part Number: R0603_90K9_1%_0.1W_100PPM; Component Kind: Standard; Component Type: Standard; Pin Count: 2; Value: 90k9; Status: Preferred; Tolerance: ±1%; Manufacturer Part Number: R0603_90K9_1%_0.1W_100PPM; Case: 0603; Mounted: Yes; Sense: No; Socket: No; SMD: Yes; Manufacturer1 Example: VISHAY; Manufacturer1 ComponentHeight: 0.55mm; HelpURL: \\cern.ch\dfs\Applications\Altium\Datasheets\R0603_VISHAY_CRCW e3.pdf; Author: CERN DEM JLC; CreateDate: 14.03.2018; LatestRevisionDate: 14.03.2018
R564 = R0603_13K3_0.1%_0.063W_10PPM: Resistor - 0.1%; Part Description: Thin Film Chip Resistor; Manufacturer: GENERIC; Manufacturer1 Part Number: RN73C1J13K3BTDF; Power: 0.063W; TC: ±10ppm; PressFit: No; Part Number: R0603_13K3_0.1%_0.063W_10PPM; Component Kind: Standard; Component Type: Standard; Pin Count: 2; Value: 13k3; Status: Not Recommended; Tolerance: ±0.1%; Manufacturer Part Number: R0603_13K3_0.1%_0.063W_10PPM; Case: 0603; Mounted: Yes; Sense: No; Socket: No; SMD: Yes; Manufacturer1 Example: TYCO HOLSWORTHY; Manufacturer1 ComponentHeight: 0.5mm; HelpURL: \\cern.ch\dfs\Applications\Altium\Datasheets\R0603_Tyco_RN73.pdf; Author: CERN DEM JLC; CreateDate: 03.12.2007; LatestRevisionDate: 13.03.2008
T4 T7 = BSS138LT1G: N-CHANNEL MOSFET WITH DIODE; Manufacturer: ON SEMICONDUCTOR; Part Description: 50V 200mA N-Channel Enhancement Mode Field-Effect Transistor; Bonding: No; PressFit: No; Case: SOT23-3; ComponentHeight: 1.11mm; Device: BSS138LT1G; Manufacturer Part Number: BSS138LT1G; Mounted: Yes; PackageDescription: SOT23 3-Leads, Pitch 0.95mm - Body 1.4x3mm, IPC Medium Density; Part Number: BSS138LT1G; Pin Count: 3; Sense: No; SMD: Yes; Socket: No; Component Kind: Standard; Component Type: Standard; HelpURL: \\cern.ch\dfs\Applications\Altium\Datasheets\BSS138LT1G.pdf; Author: CERN DEM JLC; CreateDate: 23.03.2009; LatestRevisionDate: 23.03.2009
T5 T6 = BC847BV: 45V, 100mA NPN General Purpose Double Transistor; Manufacturer: NXP SEMICONDUCTORS; Part Description: 45V 100mA NPN General Purpose Double Transistor; Bonding: No; PressFit: No; Case: SOT666; ComponentHeight: 0.6mm; Device: BC847BV; Manufacturer Part Number: BC847BV; Mounted: Yes; PackageDescription: SOTFL (SOT666), 0.50mm, Pitch; 6 Pin, 1.20mm W X 1.60mm L X 0.60mm H Body, IPC Medium Density; Part Number: BC847BV; Pin Count: 6; Sense: No; SMD: Yes; Socket: No; Component Kind: Standard; Component Type: Standard; HelpURL: \\cern.ch\dfs\Applications\Altium\Datasheets\BC847BV.pdf; Author: CERN DEM JLC; CreateDate: 01.12.2011; LatestRevisionDate: 01.12.2011
TP33-TP40 = TP: Testpoint
TP47 TP49-TP53 TP77 = SMD_PAD_1.27X1.27MM: Part Description: 1.27mm x 1.27mm PCB Copper Area (SMD Test Point); Mounted: No; ComponentHeight: 0mm; Family: Test Point; Part Number: SMD_PAD_1.27X1.27MM; Pin Count: 1; Sense: No; SMD: Yes; Socket: No; Status: None; Component Kind: Standard (No BOM); Component Type: Standard (No BOM); HelpURL: Undefined; Author: CERN DEM JLC; CreateDate: 12.01.2008; LatestRevisionDate: 12.01.2008; PackageDescription: 1.27mm x 1.27mm PCB Copper Area (SMD Test Point)
W1 = SAMTEC_MTLW-104-07-L-S-250: 4 Mini Wire-Wrap Contact Strip Header; Manufacturer: SAMTEC; Part Description: 4 Contacts, Pitch 2.54mm, Single Row Through Mount Straight Header (Post Lead = 6.35mm, Tail Lead 3.05mm, Insulator 1.52mm); PressFit: No; Author: CERN DEM JLC; Component Kind: Standard; Component Type: Standard; ComponentHeight: 7.87mm; CreateDate: 13.12.2012; Family: Header 4; HelpURL: \\cern.ch\dfs\Applications\Altium\Datasheets\SAMTEC_MTLW-104-07-L-S-250.pdf; LatestRevisionDate: 13.12.2012; Manufacturer Part Number: MTLW-104-07-L-S-250; Mounted: Yes; Part Number: SAMTEC_MTLW-104-07-L-S-250; Pin Count: 4; Sense: No; SMD: No; Socket: No; Status: None